# EAGLE design xbee_adapter (EAGLE 6.2)
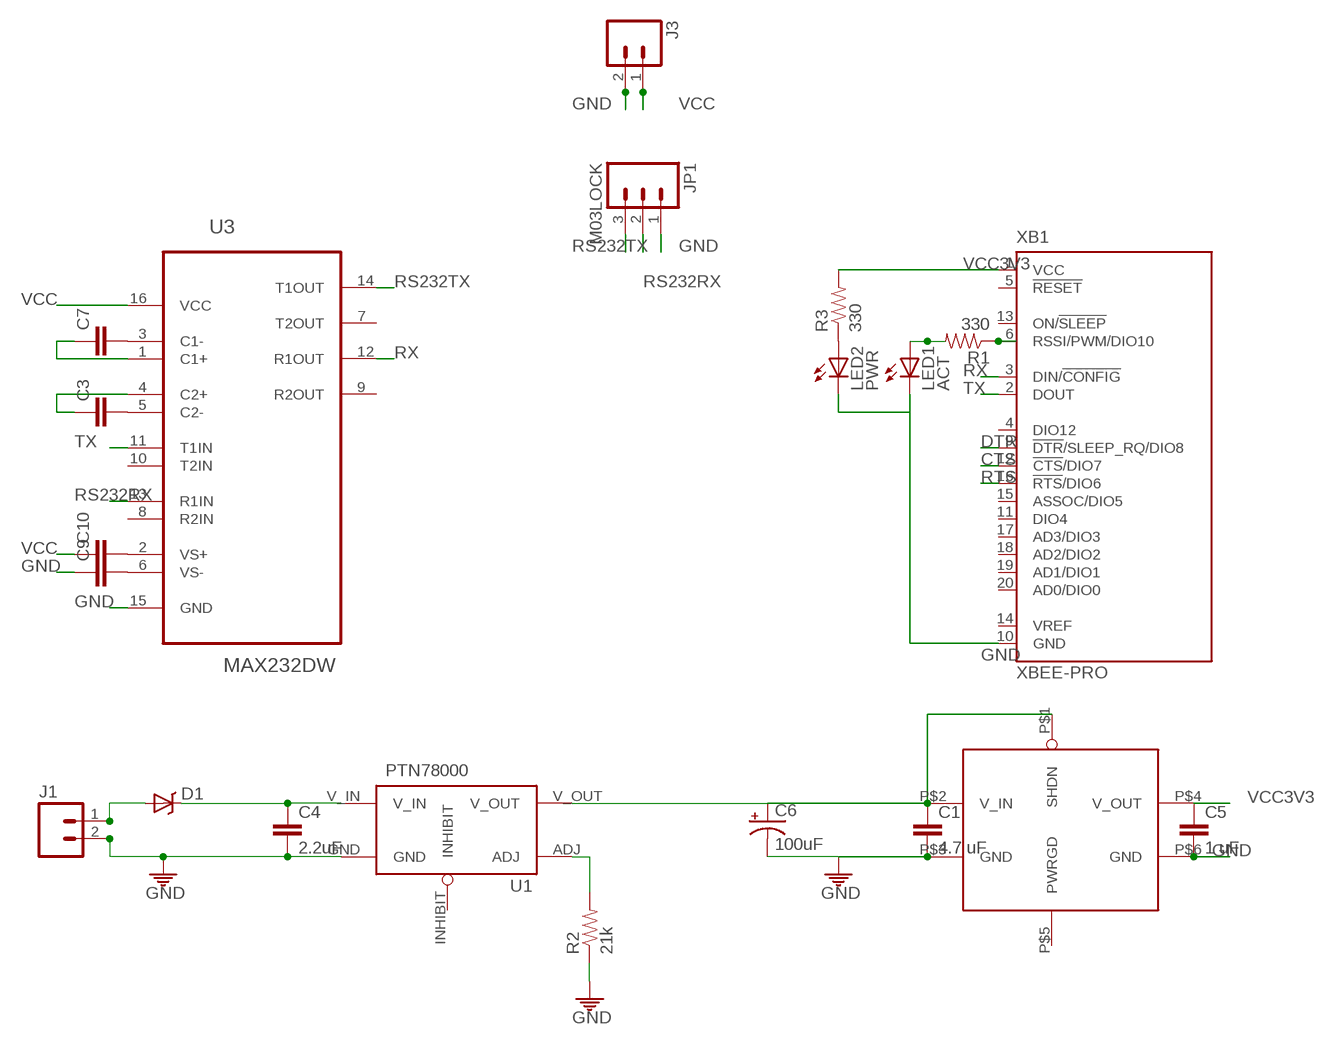
[diagram p0: schematic, sheet 1]

## Parts
C1  4.7 uF  CAP1206  [1206]
C3  CAP1206  [1206]
C4  2.2uF  CAP1206  [1206]
C5  1 uF  CAP1206  [1206]
C6  100uF  CAP_POL  [CPOL_6.6]
C7  CAP1206  [1206]
C9  CAP1206  [1206]
C10  CAP1206  [1206]
D1  DIODE-SCHOTTKY240A  [SMA-DIODE-B240A]
J1  M023.5MM-NO_SILK  [SCREWTERMINAL-3.5MM-2-NS]
J3  M023.5MM-NO_SILK  [SCREWTERMINAL-3.5MM-2-NS]
JP1  M03LOCK  [1X03_LOCK]
LED1  ACT  LED1206  [LED-1206]
LED2  PWR  LED1206  [LED-1206]
R1  330  RESISTOR0805-RES  [0805]
R2  21k  RESISTOR0805-RES  [0805]
R3  330  RESISTOR0805-RES  [0805]
U1  PTN78000  PTN78000THROUGH-HOLE  [PTN78000]
U3  MAX232DW  [SOIC127P1030X265-16N]
U$2  MCP1826  [SOT223-5]
XB1  XBEE-PRO  [XBEE-PRO]

## Nets
CTS: XB1.12(!CTS!/DIO7)
DTR: XB1.9(!DTR!/SLEEP_RQ/DIO8)
GND: C1.2 C4.2 C5.2 C6.- C9.1 J1.2 J3.2 JP1.1 LED1.C LED2.C R2.1 U1.GND U3.15(GND) U$2.P$3(GND) U$2.P$6(GND) XB1.10(GND)
N$1: C3.2 U3.5(C2-)
N$2: R1.1 XB1.6(RSSI/PWM/DIO10)
N$4: LED1.A R1.2
N$5: LED2.A R3.1
N$6 [power]: R2.2 U1.ADJ
N$7: C7.2 U3.3(C1-)
N$8 [power]: C4.1 D1.C U1.V_IN
N$9 [power]: D1.A J1.1
N$11: C9.2 U3.6(VS-)
N$12: C10.2 U3.2(VS+)
N$15: C3.1 U3.4(C2+)
N$16: C7.1 U3.1(C1+)
RS232RX: JP1.2 U3.13(R1IN)
RS232TX: JP1.3 U3.14(T1OUT)
RTS: XB1.16(!RTS!/DIO6)
RX: U3.12(R1OUT) XB1.3(DIN/!CONFIG)
TX: U3.11(T1IN) XB1.2(DOUT)
VCC: C1.1 C6.+ C10.1 J3.1 U1.V_OUT U3.16(VCC) U$2.P$1(SHDN) U$2.P$2(V_IN)
VCC3V3: C5.1 R3.2 U$2.P$4(V_OUT) XB1.1(VCC)
Unconnected: U1.INHIBIT U3.7(T2OUT) U3.8(R2IN) U3.9(R2OUT) U3.10(T2IN) U$2.P$5(PWRGD) XB1.4(DIO12) XB1.5(!RESET) XB1.11(DIO4) XB1.13(ON/!SLEEP) XB1.14(VREF) XB1.15(ASSOC/DIO5) XB1.17(AD3/DIO3) XB1.18(AD2/DIO2) XB1.19(AD1/DIO1) XB1.20(AD0/DIO0)

## Library data of the parts
C1 C3 C5 C7 C9 C10 = ASL:CAP: Capacitor Standard 0603 ceramic capacitor, and 0.1" leaded capacitor.
C4 = CMPE118lib:CAP: Capacitor Standard 0603 ceramic capacitor, and 0.1" leaded capacitor.
C6 = CMPE118lib:CAP_POL: Capacitor Polarized These are standard SMD and PTH capacitors. Normally 10uF, 47uF, and 100uF in electrolytic and tantalum varieties. Always verify the external diameter of the through hole cap, it varies with capacity, voltage, and manufacturer. The EIA devices should be standard.
D1 = CMPE118lib:DIODE-SCHOTTKY
J1 J3 = ASL:M02: Header 2 Standard 2-pin 0.1" header. Use with straight break away headers (SKU : PRT-00116), right angle break away headers (PRT-00553), swiss pins (PRT-00743), machine pins (PRT-00117), and female headers (PRT-00115). Molex polarized connector foot print use with SKU : PRT-08233 with associated crimp pins and housings.
JP1 = ASL:M03: Header 3 Standard 3-pin 0.1" header. Use with straight break away headers (SKU : PRT-00116), right angle break away headers (PRT-00553), swiss pins (PRT-00743), machine pins (PRT-00117), and female headers (PRT-00115). Molex polarized connector foot print use with SKU : PRT-08232 with associated crimp pins and housings.
LED1 LED2 = ASL:LED: LEDs Standard schematic elements and footprints for 5mm, 3mm, 1206, and 0603 sized LEDs. 5mm - Spark Fun Electronics SKU : COM-00529 (and others)
R1 R3 = ASL:RESISTOR: Resistor Basic schematic elements and footprints for 0603, 1206, and PTH resistors.
R2 = CMPE118lib:RESISTOR: Resistor Basic schematic elements and footprints for 0603, 1206, and PTH resistors.
U1 = ASL:PTN78000: This is the PTN78000 part by Texas Instruments. It's a 1.5A adjustable switching regulator.
U3 = Texas Instruments_By_element14_Batch_1:MAX232DW: Dual EIA-232 Drivers and receivers; MPN: MAX232DW; OC_FARNELL: 9589783; OC_NEWARK: 34K7924; PACKAGE: SOIC-16; SUPPLIER: Texas Instruments
U$2 = ASL:MCP1826
XB1 = xbee:XBEE: XBee (TM) /XBee-PRO(TM) OEM RF Modules Source: MaxStream, Inc. xbee_productmanual.pdf; MPN: XBP24-AWI-001; OC_FARNELL: 1337916; OC_NEWARK: 42M2667

## Net classes
0 default: width 0.406 mm, clearance 0.254 mm
1 power: width 1.27 mm, clearance 0.508 mm to class 0

## Board
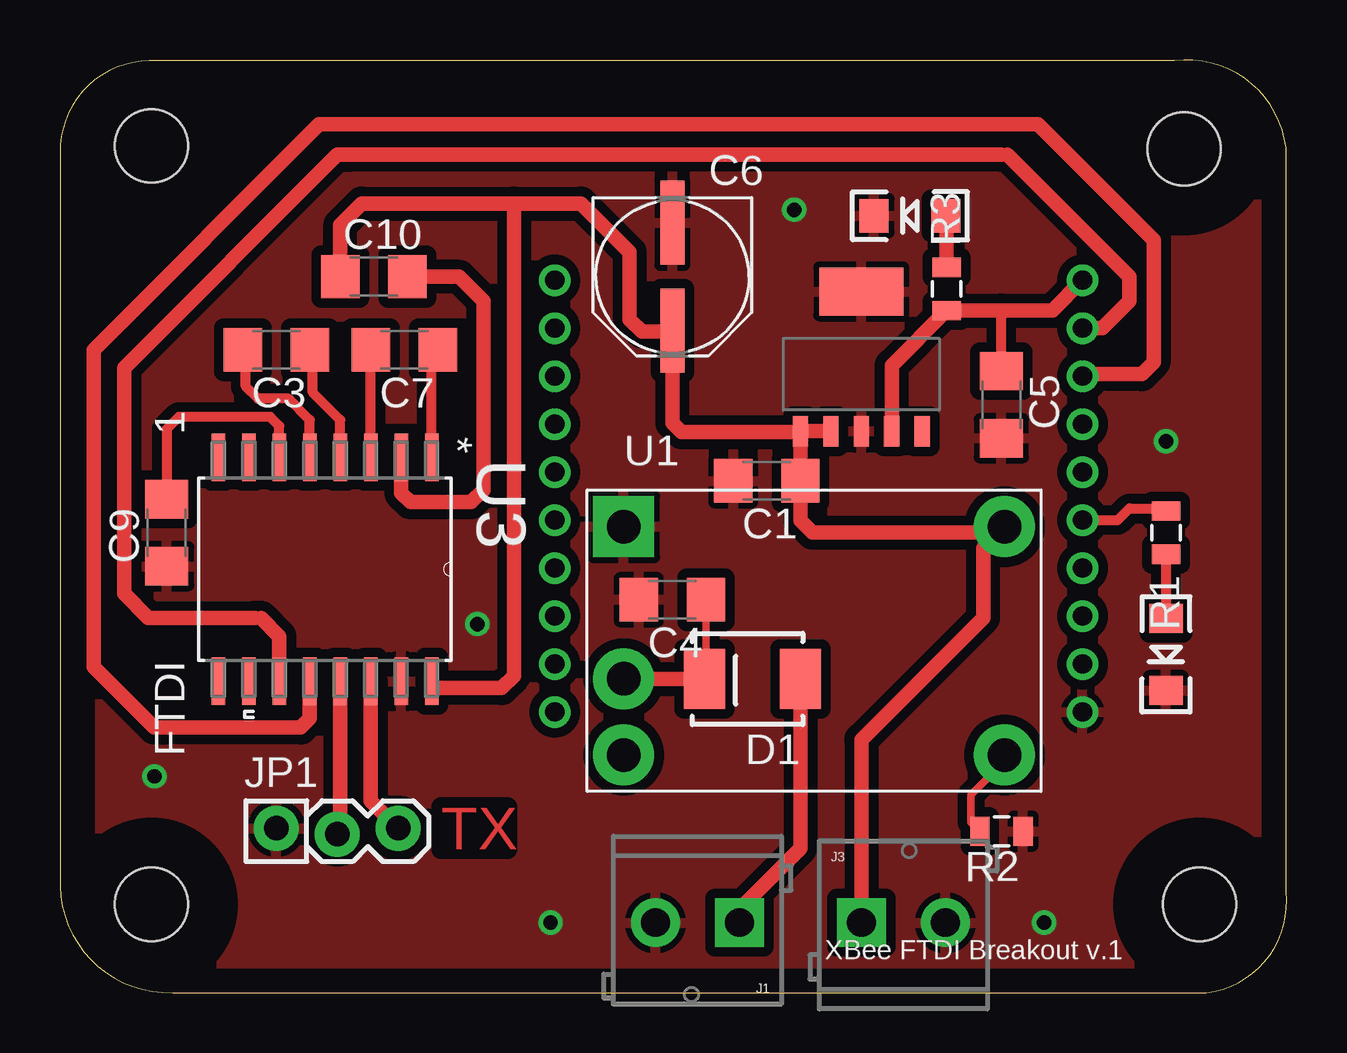
[diagram p1: board, top side]
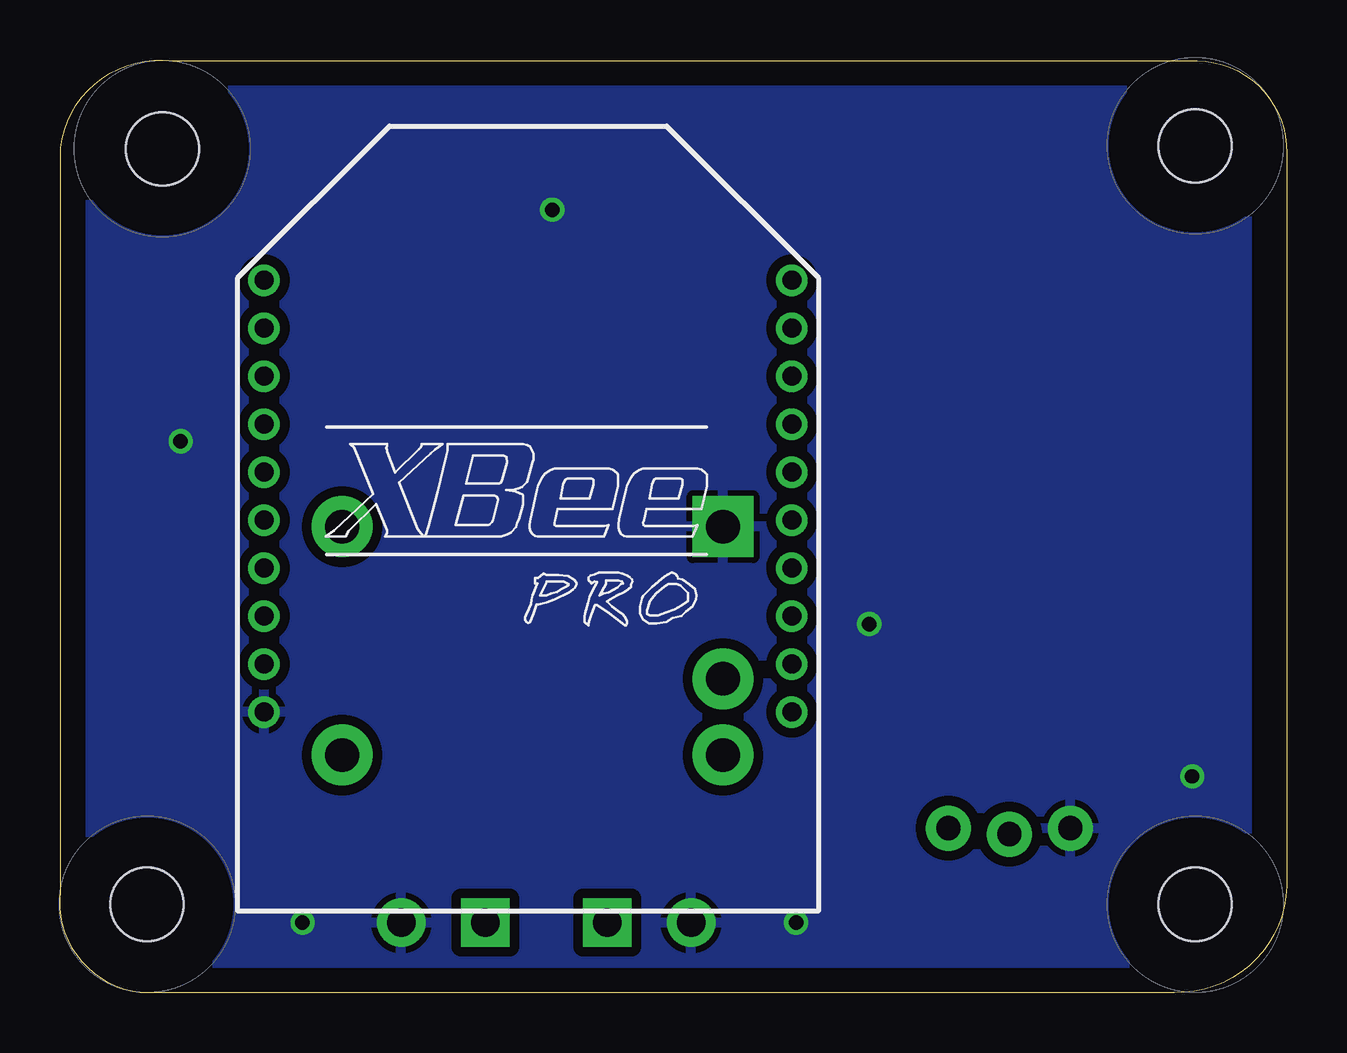
[diagram p2: board, bottom side, seen from below]

Size 51.13 x 38.88 mm. Coordinates in mm from the lower left corner, seen from the top.
Outline: 0,35 0,4.44 arc90 4.69,0 47.78,0 arc90 51.1,4.21 51.1,35.22 arc90 46.45,38.85 3.72,38.85 arc90 0,35
Copper layers (1*16): Top 0.035mm / dielectric 1.5mm / Bottom 0.035mm
Design rules: minimum track width 10mil, minimum drill 24mil, track to track 10mil, track to pad 8mil, pad to pad 8mil, via to via 8mil, smd to smd 8mil, copper to edge 40mil, drill to drill 8mil, minimum pad ring 10mil, minimum via ring 8mil, stop-mask expansion 4mil, vias tented up to drill 0mil, thermal gap 10mil

### Footprints (pad centres in the part's own frame; a part is rotated, then mirrored left to right if it is on the bottom)
1206 = smd 1.6 x 1.8: 1 -1.4,0; 2 1.4,0
CPOL_6.6 = smd 1 x 3.5: + 0,2.25; - 0,-2.25
SMA-DIODE-B240A = smd 1.7 x 2.5: A 0,0; C 4,0
STAND-OFF-TIGHT = hole 3.048: 0,0
SCREWTERMINAL-3.5MM-2-NS = drill 1.2 pad 2.032 square: 1 0,0 | drill 1.2 pad 2.032: 2 3.5,0
1X03_LOCK = drill 1.016 pad 1.88: 1 0,0.127; 2 2.54,-0.127; 3 5.08,0.127
LED-1206 = smd 1.2 x 1.4: A -1.5,0; C 1.5,0
0805 = smd 0.8 x 1.2: 1 -0.9,0; 2 0.9,0
PTN78000 = drill 1.397 pad 2.54: ADJ 15.875,-9.525; INHIBIT 0,-9.525; V_IN 0,-6.35; V_OUT 15.875,0 | drill 1.397 pad 2.54 square: GND 0,0
SOIC127P1030X265-16N = smd 1.981 x 0.559: 1 -4.674,4.445; 2 -4.674,3.175; 3 -4.674,1.905; 4 -4.674,0.635; 5 -4.674,-0.635; 6 -4.674,-1.905; 7 -4.674,-3.175; 8 -4.674,-4.445; 9 4.674,-4.445; 10 4.674,-3.175; 11 4.674,-1.905; 12 4.674,-0.635; 13 4.674,0.635; 14 4.674,1.905; 15 4.674,3.175; 16 4.674,4.445
SOT223-5 = smd 0.635 x 1.27: P$1 -2.54,-2.625; P$2 -1.27,-2.625; P$3 0,-2.625; P$4 1.27,-2.625; P$5 2.54,-2.625 | smd 3.5 x 2: P$6 0,3.2
XBEE-PRO = drill 0.8 pad 1.27: 1 -11,9; 2 -11,7; 3 -11,5; 4 -11,3; 5 -11,1; 6 -11,-1; 7 -11,-3; 8 -11,-5; 9 -11,-7; 10 -11,-9; 11 11,-9; 12 11,-7; 13 11,-5; 14 11,-3; 15 11,-1; 16 11,1; 17 11,3; 18 11,5; 19 11,7; 20 11,9

### Placement (x,y rotation side)
C1  29.46,21.34 180 top
C3  9.02,26.8 180 top
C4  25.53,16.38 180 top
C5  39.24,24.51 270 top
C6  25.53,29.84 180 top
C7  14.35,26.8 180 top
C9  4.45,19.18 90 top
C10  13.08,29.84 0 top
D1  30.86,13.08 180 top
E$2  [STAND-OFF-TIGHT]  3.81,3.68 0 top
E$3  [STAND-OFF-TIGHT]  47.5,3.68 0 top
E$4  [STAND-OFF-TIGHT]  46.86,35.18 0 top
E$5  [STAND-OFF-TIGHT]  3.81,35.31 0 top
J1  28.32,2.92 180 top
J3  33.4,2.92 0 top
JP1  9.02,6.73 0 top
LED1  46.1,14.1 270 top
LED2  35.43,32.38 180 top
R1  46.1,19.18 270 top
R2  39.24,6.73 180 top
R3  36.96,29.34 270 top
U1  23.5,19.43 0 top
U3  11.05,17.65 270 top
U$2  33.4,26.04 0 top
XB1  31.62,20.7 0 bottom

### Tracks (layer width: path | path; a pad name or v marks a point on that pad's centre or on a via)
GND  (via drill 0.6)
  other vias: 46.1,22.99 17.4,15.37 30.61,32.64 3.94,9.02 41.02,2.92 20.45,2.92
  pour Top (isolate 0.406): 1.65,1.14 49.91,1.14 50.16,1.4 50.16,38.23 1.65,38.23
  pour Bottom (isolate 0.406): 1.65,1.14 49.91,1.14 50.16,1.4 50.16,38.23 1.65,38.23
N$1
  Top 0.305: 7.75,26.67 C3.2
  Top 0.406: U3.5 10.41,23.88 9.53,24.77 8.25,24.77 7.75,25.27 7.75,26.67
N$2
  Top 0.406: XB1.6 44.09,19.7 44.58,20.19 45.98,20.19 R1.1
N$4
  Top 0.406: R1.2 LED1.A
N$5
  Top 0.305: 36.96,32.36 LED2.A
  Top 0.61: R3.1 36.96,32.36
N$6
  Top 0.305: U1.ADJ 39.37,9.65 37.97,8.25 37.97,7.1 R2.2
N$7
  Top 0.305: C7.2
  Top 0.406: U3.3 C7.2
N$8
  Top 0.305: C4.1 26.93,13.15 D1.C
  Top 0.61: U1.V_IN D1.C
N$9
  Top 0.61: D1.A 30.86,6.02 28.32,3.48 J1.1
N$11
  Top 0.406: U3.6 9.14,23.62 8.76,24 4.95,24 4.45,23.5 C9.2
N$12
  Top 0.61: U3.2 14.22,20.83 14.61,20.45 17.14,20.45 17.65,20.96 17.65,28.83 16.64,29.84 C10.2
N$15
  Top 0.305: 10.54,26.67 C3.1
  Top 0.406: U3.4 11.68,23.88 10.54,25.02 10.54,26.67
N$16
  Top 0.305: 15.49,26.54 C7.1
  Top 0.406: U3.1 15.49,26.54
RS232RX
  Top 0.305: 11.68,6.73 JP1.2
  Top 0.61: U3.13 11.68,6.73
RS232TX
  Top 0.61: U3.14 12.95,8 JP1.3
RX
  Top 0.406: 42.7,25.78 XB1.3
  Top 0.61: U3.12 10.41,11.43 10.03,11.05 4.45,11.05 3.94,11.05 1.4,13.59 1.4,26.8 10.79,36.2 11.56,36.2 39.75,36.2 40.77,36.2 45.59,31.37 45.59,26.29 45.09,25.78 42.7,25.78
TX
  Top 0.406: 8.38,15.62 8.13,15.62 | 39.24,34.92 39.5,34.92
  Top 0.61: XB1.2 43.45,27.7 44.58,28.83 44.58,29.84 39.5,34.92 | 39.24,34.92 12.06,34.92 11.56,34.92 2.67,26.04 2.67,16.64 3.68,15.62 8.13,15.62 | U3.11 9.14,14.86 8.38,15.62
VCC
  Top 0.305: 39.12,19.18 U1.V_OUT | C1.1 | 30.82,23.37 U$2.P$1 | 25.49,27.56 C6.+ | 15.77,12.7 U3.16
  Top 0.61: C6.+ 25.53,23.75 25.91,23.37 30.82,23.37 | C1.1 30.86,19.68 31.37,19.18 39.12,19.18 | C1.1 U$2.P$1 U$2.P$2 | C10.1 11.68,32 12.57,32.89 18.92,32.89 | 18.92,32.89 21.72,32.89 23.75,30.86 23.75,28.07 24.26,27.56 25.49,27.56 | U1.V_OUT 38.48,18.54 38.48,15.62 33.4,10.54 J3.1 | 18.92,32.89 18.92,13.21 18.41,12.7 15.77,12.7
VCC3V3
  Top 0.406: C5.1 39.24,28.44
  Top 0.61: XB1.1 41.36,28.44 39.24,28.44 R3.2 34.67,26.15 U$2.P$4

### Text on the board
Top: TX
tNames: 1 | FTDI | XBee FTDI Breakout v.1